# Altium schematic sheet P12 Hi3519 RGMII&SPI.SchDoc
size 420 x 297 mm
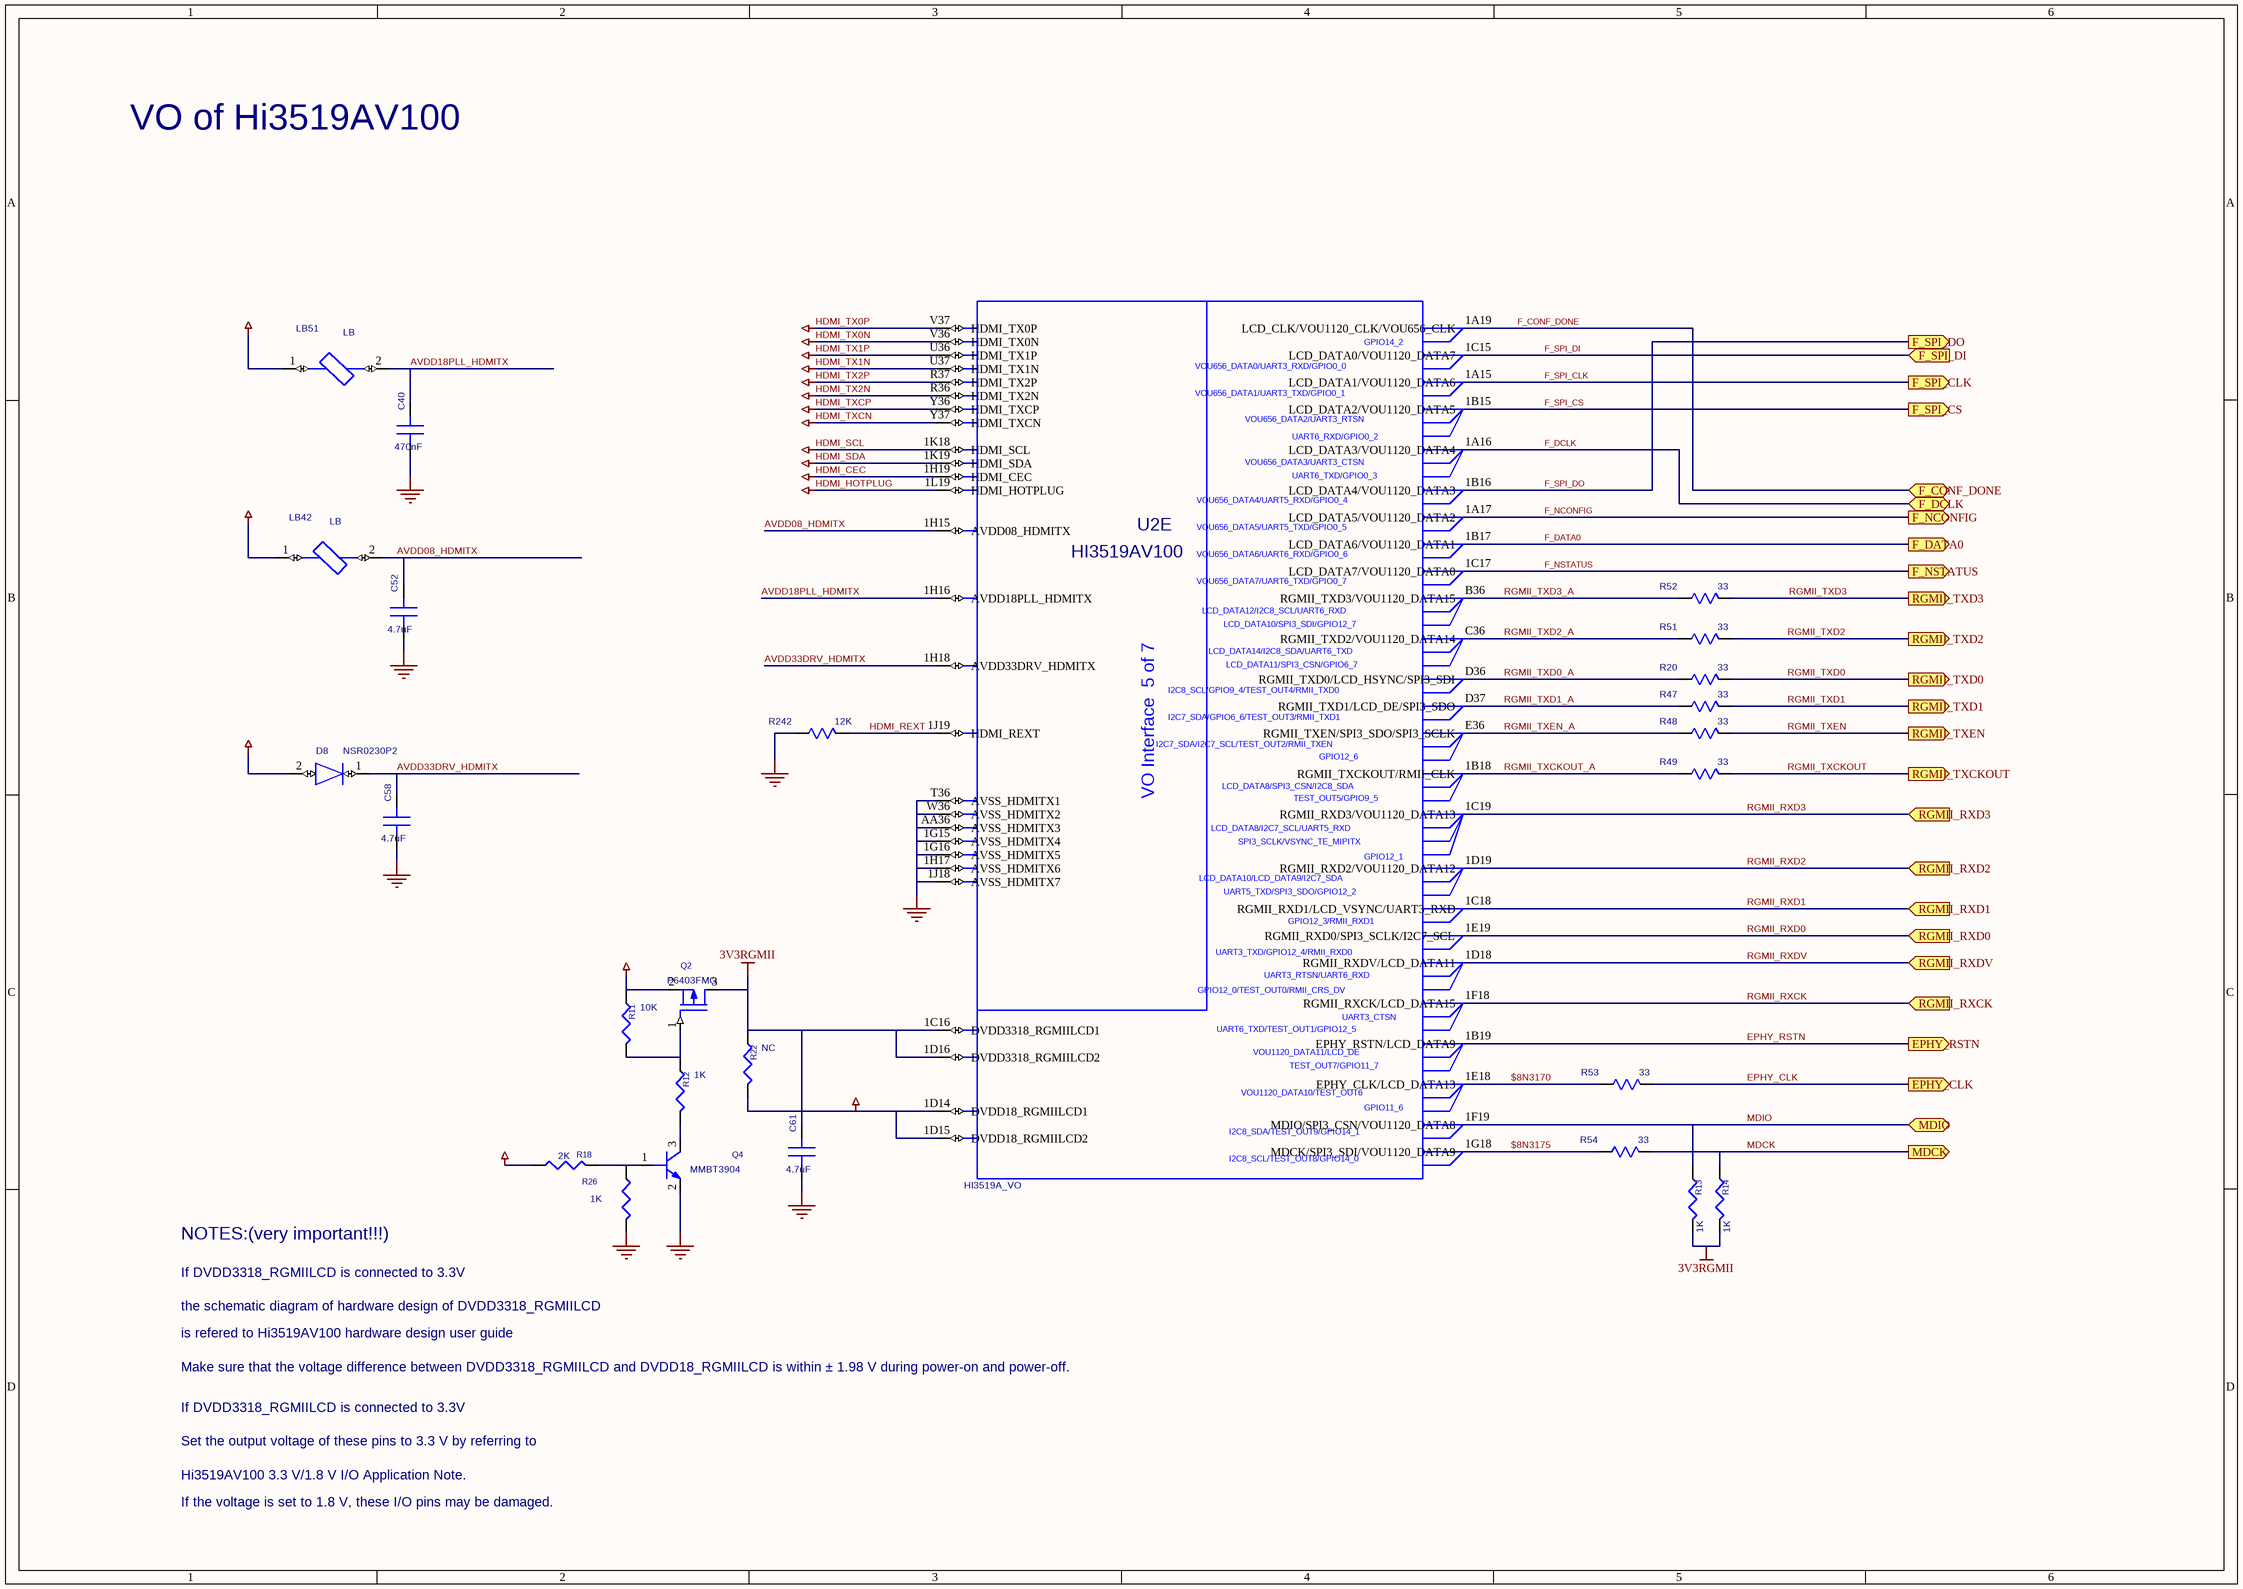
[diagram p0: P12 Hi3519 RGMII&SPI.SchDoc]

## Parts
C40  470nF  [SC0402-BGA]
C52  4.7uF  [SC0402-BGA]
C58  4.7uF  [SC0402-BGA]
C61  4.7uF  [SC0402-BGA]
D8  NSR0230P2  [HSOD323A]
LB42  LB  [SL0402]
LB51  LB  [SL0402]
Q2  P6403FMG  [SOT23]
Q4  MMBT3904  [SOT23]
R11  10K  [R0402]
R12  1K  [R0402]
R13  1K  [R0402]
R14  1K  [R0402]
R18  2K  [R0402]
R20  33  [SR0402]
R22  NC  [R0402]
R26  1K  [R0402]
R47  33  [SR0402]
R48  33  [SR0402]
R49  33  [SR0402]
R51  33  [SR0402]
R52  33  [SR0402]
R53  33  [SR0402]
R54  33  [SR0402]
R242  12K  [SR0402]
U2  HI3519A_VO  DEVICE: HI3519AV100  [HBGA567-16-3737]  (part E of 7)

## Ports
EPHY_CLK, EPHY_RSTN, F_CONF_DONE, F_DATA0, F_DCLK, F_NCONFIG, F_NSTATUS, F_SPI_CLK, F_SPI_CS, F_SPI_DI, F_SPI_DO, MDCK, MDIO, RGMII_RXCK, RGMII_RXD0, RGMII_RXD1, RGMII_RXD2, RGMII_RXD3, RGMII_RXDV, RGMII_TXCKOUT, RGMII_TXD0, RGMII_TXD1, RGMII_TXD2, RGMII_TXD3, RGMII_TXEN

## Nets
0V8_LDO: LB42.1
1V8: LB51.1 R18.2 R22.2 U2.1D14(DVDD18_RGMIILCD1) U2.1D15(DVDD18_RGMIILCD2)
3V3: D8.2(A) Q2.2(SOURCE) R11.1
3V3RGMII: C61.1(A) Q2.3(DRAIN) R13.2 R14.2 R22.1 U2.1C16(DVDD3318_RGMIILCD1) U2.1D16(DVDD3318_RGMIILCD2)
GND: C40.2(B) C52.2(B) C58.2(B) C61.2(B) Q4.2(EMITTER) R26.1 R242.1(A) U2.1G15(AVSS_HDMITX4) U2.1G16(AVSS_HDMITX5) U2.1H17(AVSS_HDMITX6) U2.1J18(AVSS_HDMITX7) U2.AA36(AVSS_HDMITX3) U2.T36(AVSS_HDMITX1) U2.W36(AVSS_HDMITX2)
HDMI_CEC: U2.1H19(HDMI_CEC)
HDMI_HOTPLUG: U2.1L19(HDMI_HOTPLUG)
HDMI_SCL: U2.1K18(HDMI_SCL)
HDMI_SDA: U2.1K19(HDMI_SDA)
HDMI_TX0N: U2.V36(HDMI_TX0N)
HDMI_TX0P: U2.V37(HDMI_TX0P)
HDMI_TX1N: U2.U37(HDMI_TX1N)
HDMI_TX1P: U2.U36(HDMI_TX1P)
HDMI_TX2N: U2.R36(HDMI_TX2N)
HDMI_TX2P: U2.R37(HDMI_TX2P)
HDMI_TXCN: U2.Y37(HDMI_TXCN)
HDMI_TXCP: U2.Y36(HDMI_TXCP)
$8N3170: R53.1(A) U2.1E18(EPHY_CLK/LCD_DATA13)
$8N3175: R54.1(A) U2.1G18(MDCK/SPI3_SDI/VOU1120_DATA9)
AVDD08_HDMITX: C52.1(A) LB42.2 U2.1H15(AVDD08_HDMITX)
AVDD18PLL_HDMITX: C40.1(A) LB51.2 U2.1H16(AVDD18PLL_HDMITX)
AVDD33DRV_HDMITX: C58.1(A) D8.1(K) U2.1H18(AVDD33DRV_HDMITX)
EPHY_CLK: R53.2(B) ; port EPHY_CLK
EPHY_RSTN: U2.1B19(EPHY_RSTN/LCD_DATA9) ; port EPHY_RSTN
F_CONF_DONE: U2.1A19(LCD_CLK/VOU1120_CLK/VOU656_CLK) ; port F_CONF_DONE
F_DATA0: U2.1B17(LCD_DATA6/VOU1120_DATA1) ; port F_DATA0
F_DCLK: U2.1A16(LCD_DATA3/VOU1120_DATA4) ; port F_DCLK
F_NCONFIG: U2.1A17(LCD_DATA5/VOU1120_DATA2) ; port F_NCONFIG
F_NSTATUS: U2.1C17(LCD_DATA7/VOU1120_DATA0) ; port F_NSTATUS
F_SPI_CLK: U2.1A15(LCD_DATA1/VOU1120_DATA6) ; port F_SPI_CLK
F_SPI_CS: U2.1B15(LCD_DATA2/VOU1120_DATA5) ; port F_SPI_CS
F_SPI_DI: U2.1C15(LCD_DATA0/VOU1120_DATA7) ; port F_SPI_DI
F_SPI_DO: U2.1B16(LCD_DATA4/VOU1120_DATA3) ; port F_SPI_DO
HDMI_REXT: R242.2(B) U2.1J19(HDMI_REXT)
MDCK: R14.1 R54.2(B) ; port MDCK
MDIO: R13.1 U2.1F19(MDIO/SPI3_CSN/VOU1120_DATA8) ; port MDIO
RGMII_RXCK: U2.1F18(RGMII_RXCK/LCD_DATA15) ; port RGMII_RXCK
RGMII_RXD0: U2.1E19(RGMII_RXD0/SPI3_SCLK/I2C7_SCL) ; port RGMII_RXD0
RGMII_RXD1: U2.1C18(RGMII_RXD1/LCD_VSYNC/UART3_RXD) ; port RGMII_RXD1
RGMII_RXD2: U2.1D19(RGMII_RXD2/VOU1120_DATA12) ; port RGMII_RXD2
RGMII_RXD3: U2.1C19(RGMII_RXD3/VOU1120_DATA13) ; port RGMII_RXD3
RGMII_RXDV: U2.1D18(RGMII_RXDV/LCD_DATA11) ; port RGMII_RXDV
RGMII_TXCKOUT: R49.2(B) ; port RGMII_TXCKOUT
RGMII_TXCKOUT_A: R49.1(A) U2.1B18(RGMII_TXCKOUT/RMII_CLK)
RGMII_TXD0: R20.2(B) ; port RGMII_TXD0
RGMII_TXD0_A: R20.1(A) U2.D36(RGMII_TXD0/LCD_HSYNC/SPI3_SDI)
RGMII_TXD1: R47.2(B) ; port RGMII_TXD1
RGMII_TXD1_A: R47.1(A) U2.D37(RGMII_TXD1/LCD_DE/SPI3_SDO)
RGMII_TXD2: R51.2(B) ; port RGMII_TXD2
RGMII_TXD2_A: R51.1(A) U2.C36(RGMII_TXD2/VOU1120_DATA14)
RGMII_TXD3: R52.2(B) ; port RGMII_TXD3
RGMII_TXD3_A: R52.1(A) U2.B36(RGMII_TXD3/VOU1120_DATA15)
RGMII_TXEN: R48.2(B) ; port RGMII_TXEN
RGMII_TXEN_A: R48.1(A) U2.E36(RGMII_TXEN/SPI3_SDO/SPI3_SCLK)
NetQ2_1: Q2.1(GATE) R11.2 R12.1
NetQ4_1: Q4.1(BASE) R18.1 R26.2
NetQ4_3: Q4.3(COLLECTOR) R12.2

## Notes on the sheet
- VO of Hi3519AV100
- NOTES:(very important!!!)
- is refered to Hi3519AV100 hardware design user guide
- If DVDD3318_RGMIILCD is connected to 3.3V
- the schematic diagram of hardware design of DVDD3318_RGMIILCD
- Make sure that the voltage difference between DVDD3318_RGMIILCD and DVDD18_RGMIILCD is within ± 1.98 V during power-on and power-off.
- Set the output voltage of these pins to 3.3 V by referring to
- Hi3519AV100 3.3 V/1.8 V I/O Application Note.
- If the voltage is set to 1.8 V, these I/O pins may be damaged.
- (in symbol HI3519A_VO_5, part E) GPIO14_2; VOU656_DATA0/UART3_RXD/GPIO0_0; VOU656_DATA1/UART3_TXD/GPIO0_1; VOU656_DATA2/UART3_RTSN; UART6_RXD/GPIO0_2; VOU656_DATA3/UART3_CTSN; UART6_TXD/GPIO0_3; VOU656_DATA4/UART5_RXD/GPIO0_4; VOU656_DATA5/UART5_TXD/GPIO0_5; VOU656_DATA6/UART6_RXD/GPIO0_6; VOU656_DATA7/UART6_TXD/GPIO0_7; LCD_DATA12/I2C8_SCL/UART6_RXD; LCD_DATA10/SPI3_SDI/GPIO12_7; LCD_DATA14/I2C8_SDA/UART6_TXD; LCD_DATA11/SPI3_CSN/GPIO6_7; I2C8_SCL/GPIO9_4/TEST_OUT4/RMII_TXD0; I2C7_SDA/GPIO6_6/TEST_OUT3/RMII_TXD1; I2C7_SDA/I2C7_SCL/TEST_OUT2/RMII_TXEN; GPIO12_6; LCD_DATA8/SPI3_CSN/I2C8_SDA; VO Interface  5 of 7; TEST_OUT5/GPIO9_5; LCD_DATA8/I2C7_SCL/UART5_RXD; SPI3_SCLK/VSYNC_TE_MIPITX; GPIO12_1; LCD_DATA10/LCD_DATA9/I2C7_SDA; UART5_TXD/SPI3_SDO/GPIO12_2; GPIO12_3/RMII_RXD1; UART3_TXD/GPIO12_4/RMII_RXD0; UART3_RTSN/UART6_RXD; GPIO12_0/TEST_OUT0/RMII_CRS_DV; UART3_CTSN; UART6_TXD/TEST_OUT1/GPIO12_5; VOU1120_DATA11/LCD_DE; TEST_OUT7/GPIO11_7; VOU1120_DATA10/TEST_OUT6; GPIO11_6; I2C8_SDA/TEST_OUT9/GPIO14_1; I2C8_SCL/TEST_OUT8/GPIO14_0

## Library data of the parts
C40 = C: PARTS: 1; OriginalSymbolOrigin: (0,0); DEVICE: GRM155R71A474KE01D; LEVEL: STD; PINSWAP: (A,B); %208%%161%%192%%224%%195%%251%%179%%198%: SMD陶瓷电容; %195%%232%%202%%246%: SMD陶瓷电容-6.3V-470nF-+/-10%-X7R-0402; CODE: 8072110; COMPONENT_HIGH_MAX: -999999mm; %182%%238%%182%%168%%185%%164%%215%%247%%181%%231%%209%%185%(V): 6.3; PKG_TYPE: SC0402-BGA
C52 C58 C61 = C: PARTS: 1; OriginalSymbolOrigin: (0,0); DEVICE: CM05X6T475M06AH-HW; LEVEL: STD; PINSWAP: (A,B); CODE: 8072081; %195%%232%%202%%246%: SMD陶瓷电容-6.3V-4700nF-+/-20%-X6T-0402-华技终端专用; %182%%238%%182%%168%%185%%164%%215%%247%%181%%231%%209%%185%(V): 6.3; COMPONENT_HIGH_MAX: -999999mm; %208%%161%%192%%224%%195%%251%%179%%198%: SMD陶瓷电容; PKG_TYPE: SC0402-BGA
D8 = D_A: PARTS: 1; LEVEL: STD; PKG_TYPE: SOD-923-2; CODE: HBVTA002; OriginalSymbolOrigin: (20,20); COMPONENT_HIGH_MAX: 1.1MM; %195%%232%%202%%246%: 肖特基二极管-10V-3A-0.24V-SOD323-手机专用; %208%%161%%192%%224%%195%%251%%179%%198%: 肖特基二极管; DEVICE: NSR0230P2
LB42 = LB: PARTS: 1; OriginalSymbolOrigin: (0,0); LEVEL: STD; DEVICE: BLM15PD121SN1D; %208%%161%%192%%224%%195%%251%%179%%198%: 终端EMI磁珠; COMPONENT_HIGH_MAX: 0.55MM; %195%%232%%202%%246%: 终端EMI磁珠-120ohm-+/- 25%-1A-0.12ohm-0402-终端专用; CODE: 10100616; PKG_TYPE: SL0402
LB51 = LB_Dup1: PARTS: 1; OriginalSymbolOrigin: (0,0); LEVEL: STD; DEVICE: BLM15HG102SN1D; %208%%161%%192%%224%%195%%251%%179%%198%: EMI磁珠; COMPONENT_HIGH_MAX: 0.65MM; %195%%232%%202%%246%: EMI磁珠-+/-25%-1000ohm-1.25ohm-0.25A-0402-1400ohm@1GHZ; CODE: 10070019; PKG_TYPE: SL0402
Q2 = MOSFET P_0
Q4 = 2N3904
R11-R14 R18 R22 R26 = R
R20 R47 R49 R52 R54 = R_Dup1: PARTS: 1; OriginalSymbolOrigin: (0,0); PINSWAP: (A,B); DEVICE: RC0402FR_0733RL; LEVEL: STD; CODE: 7090836; %195%%232%%202%%246%: 片式厚膜电阻器-0.0625W-33ohm-+/-1%-0402; %182%%238%%182%%168%%185%%166%%194%%202%(W): 0.06; %215%%232%%214%%181%%212%%202%%208%%237%%198%%171%%178%%238%: +/-1%; COMPONENT_HIGH_MAX: 0.4MM; %208%%161%%192%%224%%195%%251%%179%%198%: 片式厚膜电阻器; PKG_TYPE: SR0402
R48 R51 R53 = R_Dup1: PARTS: 1; OriginalSymbolOrigin: (0,0); PINSWAP: (A,B); DEVICE: RC0402FR_0733RL; LEVEL: STD; %208%%161%%192%%224%%195%%251%%179%%198%: 片式厚膜电阻器; COMPONENT_HIGH_MAX: 0.4MM; %215%%232%%214%%181%%212%%202%%208%%237%%198%%171%%178%%238%: +/-1%; %182%%238%%182%%168%%185%%166%%194%%202%(W): 0.06; %195%%232%%202%%246%: 片式厚膜电阻器-0.0625W-33ohm-+/-1%-0402; CODE: 7090836; PKG_TYPE: SR0402
R242 = R_Dup1: PARTS: 1; OriginalSymbolOrigin: (0,0); PINSWAP: (A,B); DEVICE: RC0402FR_0712K; LEVEL: STD; CODE: 7090817; %195%%232%%202%%246%: 片式厚膜电阻器-0.0625W-12000ohm-+/-1%-0402; %182%%238%%182%%168%%185%%166%%194%%202%(W): 0.06; %215%%232%%214%%181%%212%%202%%208%%237%%198%%171%%178%%238%: +/-1%; COMPONENT_HIGH_MAX: 0.4MM; %208%%161%%192%%224%%195%%251%%179%%198%: 片式厚膜电阻器; PKG_TYPE: SR0402
U2 = HI3519A_VO_5: PARTS: 1; OriginalSymbolOrigin: (0,0); LEVEL: STD; HETERO: (HI3519A_DDR),(HI3519A_MIPI),(HI3519A_PER),(HI3519A_SYS),(HI3519A_VO),(HI3519A_PWR),(HI3519A_VSS); CaptureCellPackProp: HI3519A_VOE; PKG_TYPE: HBGA567-16-3737